# EAGLE design New_Glove (EAGLE 5.06)
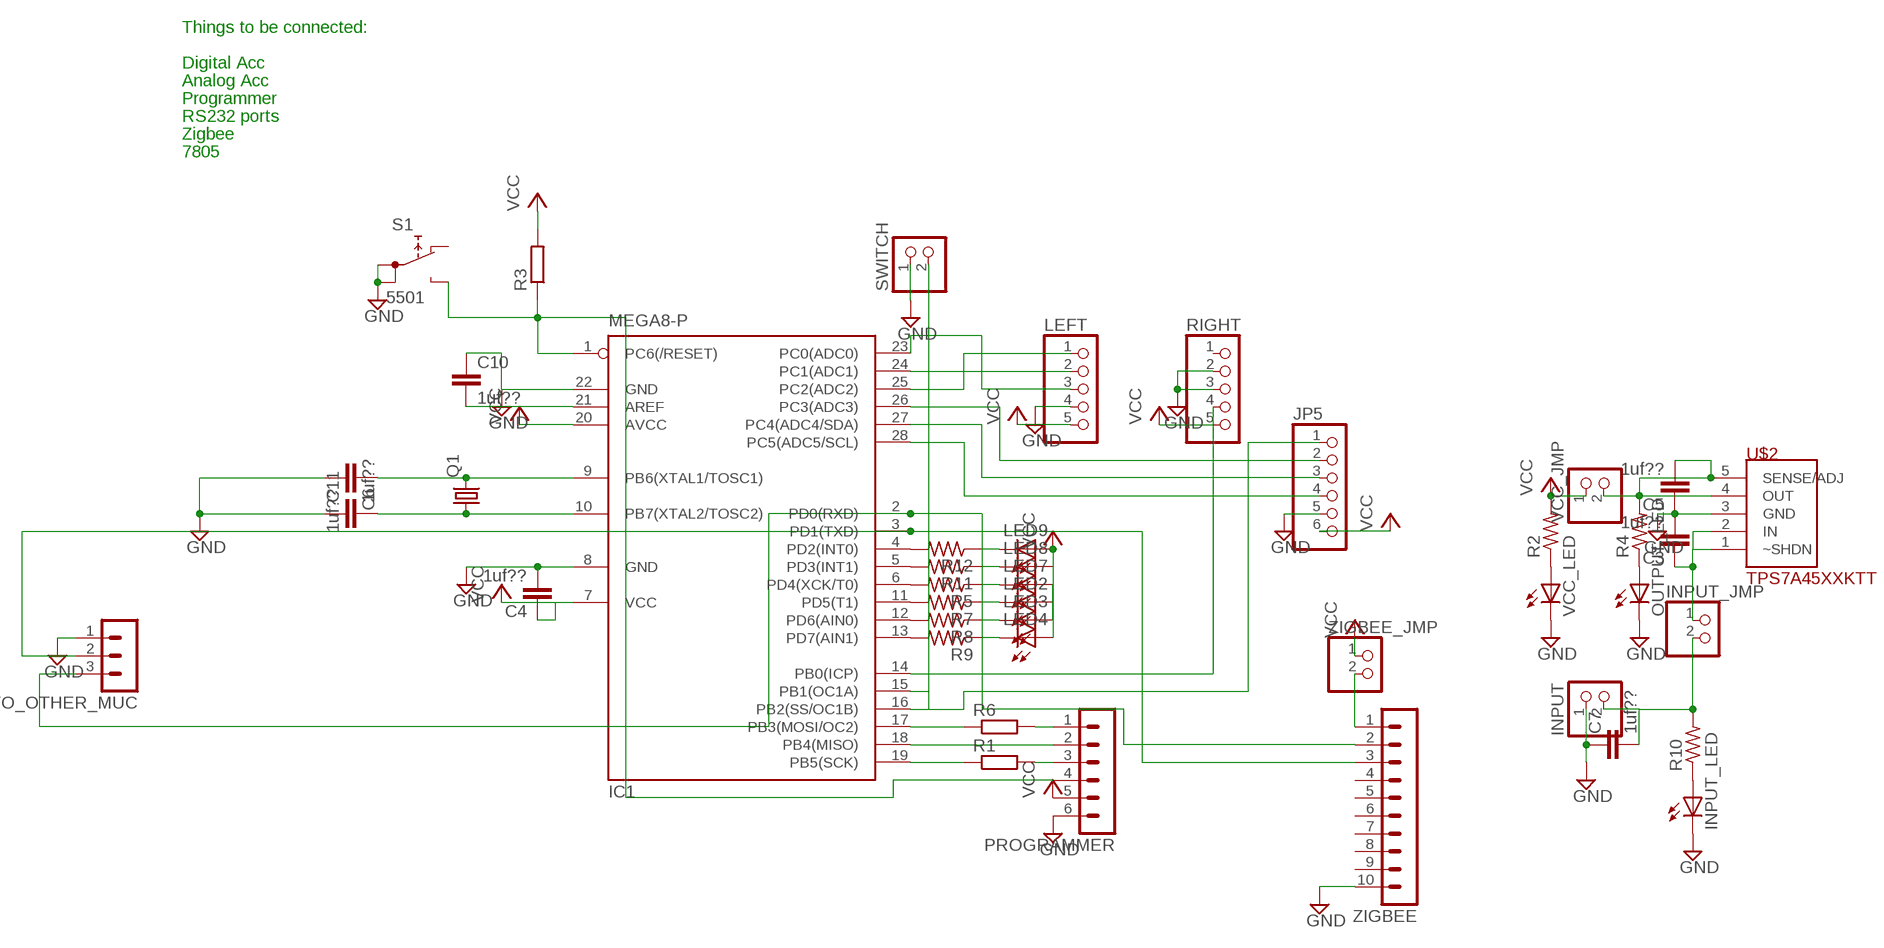
[diagram p0: schematic, sheet 1]

## Parts
C3  1uf??  C-EU025-025X050  [C025-025X050]
C4  1uf??  C-EU025-025X050  [C025-025X050]
C5  1uf??  C-EU025-025X050  [C025-025X050]
C6  1uf??  C-EU025-025X050  [C025-025X050]
C7  1uf??  C-EU025-025X050  [C025-025X050]
C10  1uf??  C-EU025-025X050  [C025-025X050]
C11  1uf??  C-EU025-025X050  [C025-025X050]
IC1  MEGA8-P  [DIL28-3]
INPUT  PINHD-1X2  [1X02]
INPUT_JMP  PINHD-1X2  [1X02]
INPUT_LED  LEDSMT1206  [1206]
JP5  PINHD-1X6  [1X06]
LED2  LEDSMT1206  [1206]
LED3  LEDSMT1206  [1206]
LED4  LEDSMT1206  [1206]
LED7  LEDSMT1206  [1206]
LED8  LEDSMT1206  [1206]
LED9  LEDSMT1206  [1206]
LEFT  PINHD-1X5  [1X05]
OUTPUT_LED  LEDSMT1206  [1206]
PROGRAMMER  MA06-1  [MA06-1]
Q1  CRYSTALHC49S  [HC49/S]
R1  R-EU_0207/7  [0207/7]
R2  R-US_R1206  [R1206]
R3  R-EU_0207/7  [0207/7]
R4  R-US_R1206  [R1206]
R5  R-US_R1206  [R1206]
R6  R-EU_0207/7  [0207/7]
R7  R-US_R1206  [R1206]
R8  R-US_R1206  [R1206]
R9  R-US_R1206  [R1206]
R10  R-US_R1206  [R1206]
R11  R-US_R1206  [R1206]
R12  R-US_R1206  [R1206]
RIGHT  PINHD-1X5  [1X05]
S1  5501  [5501]
SWITCH  PINHD-1X2  [1X02]
TO_OTHER_MUC  MA03-1  [MA03-1]
U$2  TPS7A45XXKTT  [TO263-5]
VCC_JMP  PINHD-1X2  [1X02]
VCC_LED  LEDSMT1206  [1206]
ZIGBEE  MA10-1  [MA10-1]
ZIGBEE_JMP  PINHD-1X2  [1X02]

## Nets
AC4: IC1.14(PB0(ICP)) RIGHT.4
GND: C3.2 C4.2 C5.1 C6.2 C7.1 C10.1 C11.1 IC1.8(GND) IC1.22(GND) INPUT.1 INPUT_LED.C JP5.5 LEFT.4 OUTPUT_LED.C PROGRAMMER.6 RIGHT.2 RIGHT.3 S1.1A S1.1B SWITCH.1 TO_OTHER_MUC.1 U$2.3(GND) VCC_LED.C ZIGBEE.10
N$1: IC1.17(PB3(MOSI/OC2)) R6.1
N$2: PROGRAMMER.1 R6.2
N$3: IC1.18(PB4(MISO)) PROGRAMMER.2
N$4: IC1.19(PB5(SCK)) R1.1
N$5: PROGRAMMER.3 R1.2
N$6: IC1.1(PC6(/RESET)) PROGRAMMER.4 R3.1 S1.NO
N$7: C11.2 IC1.10(PB7(XTAL2/TOSC2)) Q1.1
N$8: C6.1 IC1.9(PB6(XTAL1/TOSC1)) Q1.2
N$9: ZIGBEE.1 ZIGBEE_JMP.2
N$10: IC1.25(PC2(ADC2)) LEFT.1
N$11: IC1.24(PC1(ADC1)) LEFT.2
N$12: IC1.23(PC0(ADC0)) LEFT.3
N$13: R2.1 VCC_LED.A
N$14: IC1.26(PC3(ADC3)) JP5.2
N$15: C7.2 INPUT.2 INPUT_JMP.2 R10.2
N$16: IC1.27(PC4(ADC4/SDA)) JP5.3
N$17: OUTPUT_LED.A R4.1
N$18: IC1.2(PD0(RXD)) TO_OTHER_MUC.3 ZIGBEE.2
N$19: IC1.28(PC5(ADC5/SCL)) JP5.4
N$20: IC1.16(PB2(SS/OC1B)) JP5.1
N$21: C10.2 IC1.21(AREF)
N$23: IC1.6(PD4(XCK/T0)) R5.2
N$24: IC1.5(PD3(INT1)) R11.2
N$25: IC1.15(PB1(OC1A)) SWITCH.2
N$26: LED8.C R11.1
N$27: LED9.C R12.1
N$28: LED2.C R7.1
N$29: INPUT_LED.A R10.1
N$30: C5.2 R4.2 U$2.4(OUT) U$2.5(SENSE/ADJ) VCC_JMP.2
N$31: C3.1 INPUT_JMP.1 U$2.1(~SHDN) U$2.2(IN)
N$32: LED7.C R5.1
N$33: LED3.C R8.1
N$34: LED4.C R9.1
N$35: IC1.4(PD2(INT0)) R12.2
N$36: IC1.11(PD5(T1)) R7.2
N$37: IC1.12(PD6(AIN0)) R8.2
N$38: IC1.13(PD7(AIN1)) R9.2
N$39: IC1.3(PD1(TXD)) TO_OTHER_MUC.2 ZIGBEE.3
VCC: C4.1 IC1.7(VCC) IC1.20(AVCC) JP5.6 LED2.A LED3.A LED4.A LED7.A LED8.A LED9.A LEFT.5 PROGRAMMER.5 R2.2 R3.2 RIGHT.5 VCC_JMP.1 ZIGBEE_JMP.1
Unconnected: RIGHT.1 S1.NC ZIGBEE.4 ZIGBEE.5 ZIGBEE.6 ZIGBEE.7 ZIGBEE.8 ZIGBEE.9

## Notes on the sheet
- Things to be connected:
- Digital Acc
- Analog Acc
- Programmer
- RS232 ports
- Zigbee
- 7805

## Library data of the parts
C3-C7 C10 C11 = rcl:C-EU: CAPACITOR, European symbol
IC1 = atmel:MEGA8-P: MICROCONTROLLER 8 Kbytes FLASH, 1 kbytes SRAM, 512 bytes EEPROM, USART, 4-channel 10 bit ADC, 2-channel 8 bit ADC Pin compatible with Atmega48, ATMega88, ATMega168 Source: avr.lbr
INPUT INPUT_JMP SWITCH VCC_JMP ZIGBEE_JMP = pinhead:PINHD-1X2: PIN HEADER
INPUT_LED LED2-LED4 LED7-LED9 OUTPUT_LED VCC_LED = led:LED: LED OSRAM: - CHIPLED LG R971, LG N971, LY N971, LG Q971, LY Q971, LO R971, LY R971 LH N974, LH R974 LS Q976, LO Q976, LY Q976 LO Q996 - Hyper CHIPLED LW Q18S LB Q993, LB Q99A, LB R99A - SideLED LS A670, LO A670, LY A670, LG A670, LP A670 LB A673, LV A673, LT A673, LW A673 LH A674 LY A675 LS A676, LA A676, LO A676, LY A676, LW A676 LS A679, LY A679, LG A679 - Hyper Micro SIDELED® LS Y876, LA Y876, LO Y876, LY Y876 LT Y87S - SmartLED LW L88C, LW L88S LB L89C, LB L89S, LG L890 LS L89K, LO L89K, LY L89K LS L896, LA L896, LO L896, LY L896 - TOPLED LS T670, LO T670, LY T670, LG T670, LP T670 LSG T670, LSP T670, LSY T670, LOP T670, LYG T670 LG T671, LOG T671, LSG T671 LB T673, LV T673, LT T673, LW T673 LH T674 LS T676, LA T676, LO T676, LY T676, LB T676, LH T676, LSB T676, LW T676 LB T67C, LV T67C, LT T67C, LS T67K, LO T67K, LY T67K, LW E67C LS E67B, LA E67B, LO E67B, LY E67B, LB E67C, LV E67C, LT E67C LW T67C LS T679, LY T679, LG T679 LS T770, LO T770, LY T770, LG T770, LP T770 LB T773, LV T773, LT T773, LW T773 LH T774 LS E675, LA E675, LY E675, LS T675 LS T776, LA T776, LO T776, LY T776, LB T776 LHGB T686 LT T68C, LB T68C - Hyper Mini TOPLED® LB M676 - Mini TOPLED Santana® LG M470 LS M47K, LO M47K, LY M47K Source: http://www.osram.convergy.de LUXEON: - LUMILED® LXK2-PW12-R00, LXK2-PW12-S00, LXK2-PW14-U00, LXK2-PW14-V00 LXK2-PM12-R00, LXK2-PM12-S00, LXK2-PM14-U00 LXK2-PE12-Q00, LXK2-PE12-R00, LXK2-PE12-S00, LXK2-PE14-T00, LXK2-PE14-U00 LXK2-PB12-K00, LXK2-PB12-L00, LXK2-PB12-M00, LXK2-PB14-N00, LXK2-PB14-P00, LXK2-PB14-Q00 LXK2-PR12-L00, LXK2-PR12-M00, LXK2-PR14-Q00, LXK2-PR14-R00 LXK2-PD12-Q00, LXK2-PD12-R00, LXK2-PD12-S00 LXK2-PH12-R00, LXK2-PH12-S00 LXK2-PL12-P00, LXK2-PL12-Q00, LXK2-PL12-R00 Source: www.luxeon.com KINGBRIGHT: KA-3528ASYC Source: www.kingbright.com
JP5 = pinhead:PINHD-1X6: PIN HEADER
LEFT RIGHT = pinhead:PINHD-1X5: PIN HEADER
PROGRAMMER = con-lstb:MA06-1: PIN HEADER
Q1 = crystal:CRYSTAL: CRYSTAL
R1 R3 R6 = resistor:R-EU_: RESISTOR, European symbol
R2 R4 R5 R7-R12 = resistor:R-US_: RESISTOR, American symbol
S1 = switch:55?: PUSHBUTTON SERIES 5500 SWITCHES Source: www.e-switch.com .. 5500.pdf
TO_OTHER_MUC = con-lstb:MA03-1: PIN HEADER
U$2 = m:TPS7A45XX
ZIGBEE = con-lstb:MA10-1: PIN HEADER

## Board
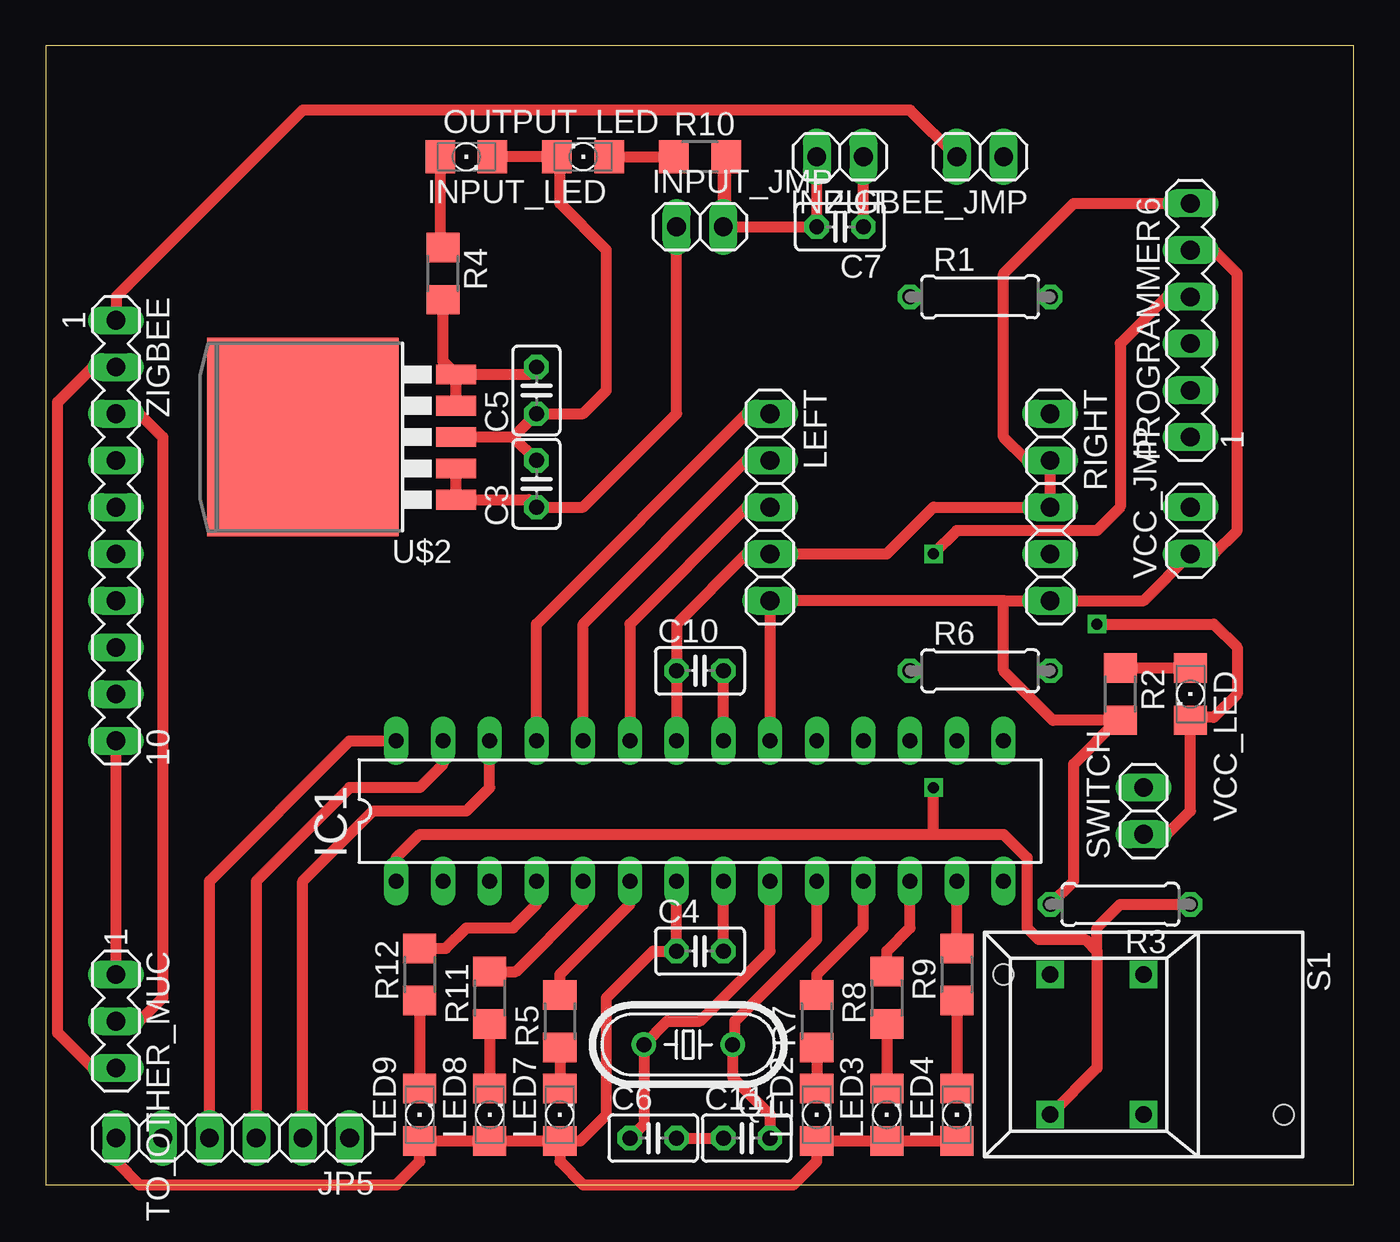
[diagram p1: board, top side]
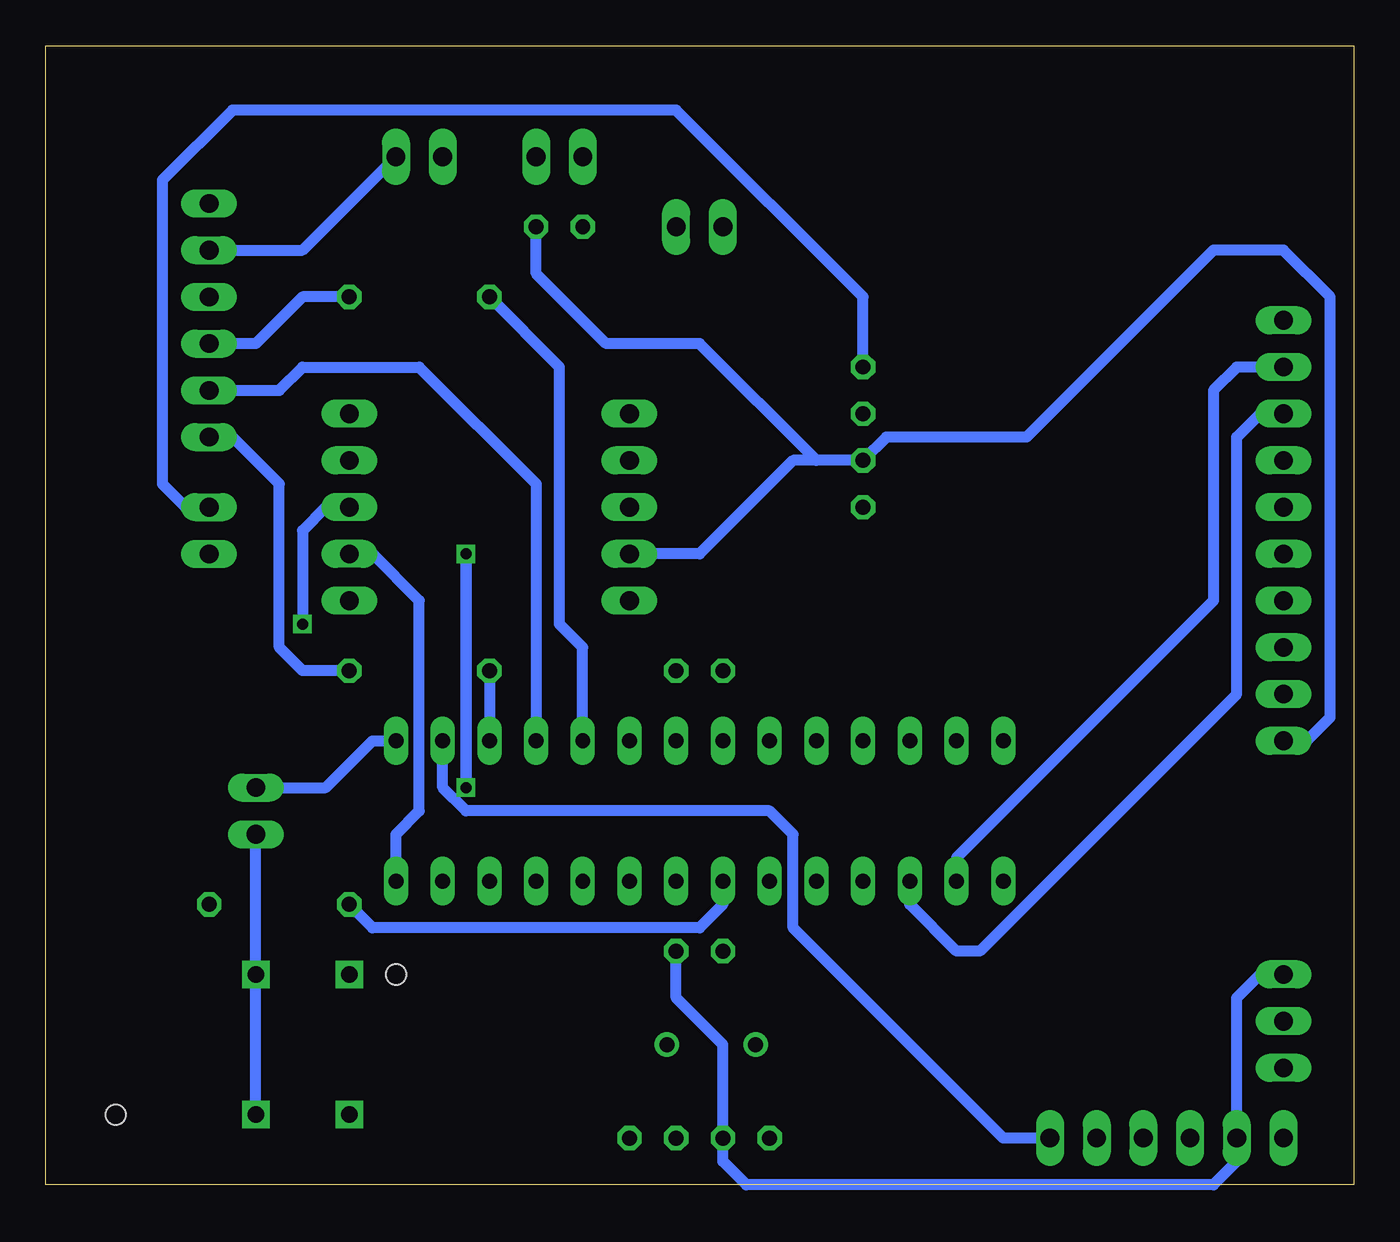
[diagram p2: board, bottom side, seen from below]

Size 71.1 x 61.9 mm. Coordinates in mm from the lower left corner, seen from the top.
Outline: 0,0 71.1,0 71.1,61.9 0,61.9 0,0
Copper layers (1*16): Top 0.035mm / dielectric 1.5mm / Bottom 0.035mm
Design rules "default": minimum track width 10mil, minimum drill 24mil, track to track 8mil, track to pad 8mil, pad to pad 8mil, via to via 8mil, smd to smd 8mil, copper to edge 40mil, drill to drill 8mil, minimum pad ring 10mil, minimum via ring 8mil, stop-mask expansion 4mil, vias tented up to drill 0mil, thermal gap 10mil

### Footprints (pad centres in the part's own frame; a part is rotated, then mirrored left to right if it is on the bottom)
C025-025X050 = drill 0.813 octagon: 1 -1.27,0; 2 1.27,0
DIL28-3 = drill 0.813 long: 1 -16.51,-3.81; 2 -13.97,-3.81; 3 -11.43,-3.81; 4 -8.89,-3.81; 5 -6.35,-3.81; 6 -3.81,-3.81; 7 -1.27,-3.81; 8 1.27,-3.81; 9 3.81,-3.81; 10 6.35,-3.81; 11 8.89,-3.81; 12 11.43,-3.81; 13 13.97,-3.81; 14 16.51,-3.81; 15 16.51,3.81; 16 13.97,3.81; 17 11.43,3.81; 18 8.89,3.81; 19 6.35,3.81; 20 3.81,3.81; 21 1.27,3.81; 22 -1.27,3.81; 23 -3.81,3.81; 24 -6.35,3.81; 25 -8.89,3.81; 26 -11.43,3.81; 27 -13.97,3.81; 28 -16.51,3.81
1X02 = drill 1.016 long: 1 -1.27,0; 2 1.27,0
1206 = smd 1.6 x 1.803: A -1.422,0; C 1.422,0
1X06 = drill 1.016 long: 1 -6.35,0; 2 -3.81,0; 3 -1.27,0; 4 1.27,0; 5 3.81,0; 6 6.35,0
1X05 = drill 1.016 long: 1 -5.08,0; 2 -2.54,0; 3 0,0; 4 2.54,0; 5 5.08,0
MA06-1 = drill 1.016 long: 1 -6.35,0; 2 -3.81,0; 3 -1.27,0; 4 1.27,0; 5 3.81,0; 6 6.35,0
HC49/S = drill 0.813 round: 1 -2.413,0; 2 2.413,0
0207/7 = drill 0.813 octagon: 1 -3.81,0; 2 3.81,0
R1206 = smd 1.6 x 1.803: 1 -1.422,0; 2 1.422,0
5501 = drill 0.9 pad 1.5 square: 1A 0,3.81; 1B 0,-3.81; NC 5.08,-3.81; NO 5.08,3.81 | hole 1.1: -7.62,3.81; 7.62,-3.81
MA03-1 = drill 1.016 long: 1 -2.54,0; 2 0,0; 3 2.54,0
TO263-5 = smd 1.067 x 2.159: 1 -3.404,-5.791; 2 -1.702,-5.791; 3 0,-5.791; 4 1.702,-5.791; 5 3.404,-5.791 | smd 10.8 x 10.41: 6 0,2.54
MA10-1 = drill 1.016 long: 1 -11.43,0; 2 -8.89,0; 3 -6.35,0; 4 -3.81,0; 5 -1.27,0; 6 1.27,0; 7 3.81,0; 8 6.35,0; 9 8.89,0; 10 11.43,0

### Placement (x,y rotation side)
C3  26.67,38.1 90 top
C4  35.56,12.7 0 top
C5  26.67,43.18 90 top
C6  33.02,2.54 0 top
C7  43.18,52.07 180 top
C10  35.56,27.94 0 top
C11  38.1,2.54 0 top
IC1  35.56,20.32 0 top
INPUT  43.18,55.88 180 top
INPUT_JMP  35.56,52.07 0 top
INPUT_LED  29.21,55.88 180 top
JP5  10.16,2.54 180 top
LED2  41.91,3.81 90 top
LED3  45.72,3.81 90 top
LED4  49.53,3.81 90 top
LED7  27.94,3.81 90 top
LED8  24.13,3.81 90 top
LED9  20.32,3.81 90 top
LEFT  39.37,36.83 270 top
OUTPUT_LED  22.86,55.88 0 top
PROGRAMMER  62.23,46.99 90 top
Q1  34.92,7.62 180 top
R1  50.8,48.26 0 top
R2  58.42,26.67 270 top
R3  58.42,15.24 180 top
R4  21.59,49.53 270 top
R5  27.94,8.89 90 top
R6  50.8,27.94 0 top
R7  41.91,8.89 90 top
R8  45.72,10.16 90 top
R9  49.53,11.43 90 top
R10  35.56,55.88 0 top
R11  24.13,10.16 90 top
R12  20.32,11.43 90 top
RIGHT  54.61,36.83 270 top
S1  59.69,7.62 180 top
SWITCH  59.69,20.32 90 top
TO_OTHER_MUC  3.81,8.89 270 top
U$2  16.51,40.64 90 top
VCC_JMP  62.23,35.56 90 top
VCC_LED  62.23,26.67 270 top
ZIGBEE  3.81,35.56 270 top
ZIGBEE_JMP  50.8,55.88 180 top

### Tracks (layer width: path | path; a pad name or v marks a point on that pad's centre or on a via)
AC4
  Bottom 0.61: RIGHT.4 53.34,34.29 50.8,31.75 50.8,20.32 52.07,19.05 IC1.14
GND  (via drill 0.6)
  Top 0.61: C4.2 IC1.8 | C6.2 C11.1 | OUTPUT_LED.C INPUT_LED.C 27.94,55.73 27.94,53.34 30.48,50.8 30.48,43.18 29.21,41.91 C5.1 25.4,40.64 | 25.4,40.64 U$2.3 | C3.2 25.4,40.64 | 34.29,30.48 C10.1 IC1.22 34.29,30.48 | C7.1 INPUT.1 | 60.96,53.34 PROGRAMMER.6 55.88,53.34 52.07,49.53 52.07,40.64 53.34,39.37 RIGHT.2 RIGHT.3 48.26,36.83 45.72,34.29 LEFT.4 38.1,34.29 34.29,30.48 | SWITCH.1 60.96,19.05 62.23,20.32 VCC_LED.C 62.38,25.4 63.5,25.4 64.77,26.67 64.77,29.21 63.5,30.48 v57.15,30.48 | TO_OTHER_MUC.1 ZIGBEE.10 TO_OTHER_MUC.1
  Bottom 0.61: C4.2 36.83,10.16 34.29,7.62 C6.2 34.29,1.27 33.02,0 7.62,0 6.35,1.27 JP5.5 6.35,10.16 5.08,11.43 TO_OTHER_MUC.1 | C7.1 44.45,49.53 40.64,45.72 35.56,45.72 29.21,39.37 | C3.2 29.21,39.37 | 29.21,39.37 30.48,39.37 | S1.1A S1.1B SWITCH.1 | LEFT.4 35.56,34.29 30.48,39.37 | C3.2 30.48,39.37 | C3.2 25.4,40.64 17.78,40.64 7.62,50.8 3.81,50.8 1.27,48.26 1.27,25.4 2.54,24.13 ZIGBEE.10 | RIGHT.3 55.88,36.83 57.15,35.56 v57.15,30.48
N$1
  Bottom 0.61: R6.1 IC1.17
N$2
  Bottom 0.61: PROGRAMMER.1 60.96,40.64 58.42,38.1 58.42,29.21 57.15,27.94 R6.2
N$3
  Bottom 0.61: PROGRAMMER.2 58.42,43.18 57.15,44.45 50.8,44.45 44.45,38.1 IC1.18
N$4
  Bottom 0.61: IC1.19 41.91,29.21 43.18,30.48 43.18,44.45 R1.1
N$5
  Bottom 0.61: R1.2 57.15,48.26 59.69,45.72 PROGRAMMER.3
N$6  (via drill 0.6)
  Top 0.61: R3.1 58.42,15.24 57.15,13.97 57.15,12.7 | 57.15,12.7 57.15,6.35 S1.NO | IC1.1 19.05,17.78 20.32,19.05 48.26,19.05 | 57.15,12.7 56.52,13.34 53.98,13.34 53.34,13.97 53.34,17.78 52.07,19.05 48.26,19.05 | PROGRAMMER.4 60.96,48.26 58.42,45.72 58.42,36.83 57.15,35.56 49.53,35.56 v48.26,34.29 | 48.26,19.05 v48.26,21.59
  Bottom 0.61: v48.26,21.59 v48.26,34.29 v48.26,21.59
N$7
  Top 0.61: IC1.10 41.91,13.34 37.47,8.89 37.47,7.75 Q1.1 37.34,5.84 39.37,3.81 C11.2
N$8
  Top 0.61: IC1.9 39.37,12.7 35.56,8.89 33.78,8.89 Q1.2 32.51,3.3 C6.1
N$9
  Top 0.61: ZIGBEE_JMP.2 46.99,58.42 13.97,58.42 3.81,48.26 ZIGBEE.1
N$10
  Top 0.61: IC1.25 26.67,30.48 38.1,41.91 LEFT.1
N$11
  Top 0.61: IC1.24 29.21,30.48 38.1,39.37 LEFT.2
N$12
  Top 0.61: LEFT.3 38.1,36.83 31.75,30.48 IC1.23
N$13
  Top 0.61: R2.1 VCC_LED.A
N$14
  Top 0.61: JP5.2 13.97,16.51 17.78,20.32 22.86,20.32 24.13,21.59 IC1.26
N$15
  Top 0.61: INPUT_JMP.2 36.83,55.73 R10.2 36.98,52.22 INPUT_JMP.2 | INPUT_JMP.2 C7.2 INPUT.2
N$16
  Top 0.61: IC1.27 21.59,22.86 20.32,21.59 16.51,21.59 11.43,16.51 JP5.3
N$17
  Top 0.61: OUTPUT_LED.A 21.44,51.1 R4.1
N$18
  Top 0.61: TO_OTHER_MUC.3 2.54,6.35 0.64,8.26 0.64,42.55 2.54,44.45 ZIGBEE.2
  Bottom 0.61: IC1.2 21.59,17.78 7.62,31.75 7.62,43.18 6.35,44.45 ZIGBEE.2
N$19
  Top 0.61: JP5.4 8.89,16.51 16.51,24.13 IC1.28
N$20
  Bottom 0.61: JP5.1 19.05,2.54 30.48,13.97 30.48,19.05 31.75,20.32 48.26,20.32 49.53,21.59 IC1.16
N$21
  Top 0.61: IC1.21 C10.2
N$23
  Top 0.61: R5.2 27.94,11.43 31.75,15.24 IC1.6
N$24
  Top 0.61: R11.2 25.55,11.58 29.21,15.24 IC1.5
N$25
  Bottom 0.61: SWITCH.2 55.88,21.59 53.34,24.13 IC1.15
N$26
  Top 0.61: R11.1 LED8.C
N$27
  Top 0.61: R12.1 LED9.C
N$28
  Top 0.61: R7.1 LED2.C
N$29
  Top 0.61: INPUT_LED.A R10.1
N$30
  Top 0.61: R4.2 21.59,44.76 U$2.5 | U$2.4 U$2.5 | U$2.5 26.26,44.04 C5.2
  Bottom 0.61: C5.2 26.67,48.26 36.83,58.42 60.96,58.42 64.77,54.61 64.77,38.1 63.5,36.83 VCC_JMP.2
N$31
  Top 0.61: U$2.2 U$2.1 26.26,37.24 C3.1 29.21,36.83 34.29,41.91 INPUT_JMP.1
N$32
  Top 0.61: R5.1 LED7.C
N$33
  Top 0.61: R8.1 LED3.C
N$34
  Top 0.61: R9.1 LED4.C
N$35
  Top 0.61: R12.2 21.74,12.85 22.86,13.97 25.4,13.97 26.67,15.24 IC1.4
N$36
  Top 0.61: R7.2 41.91,11.43 44.45,13.97 IC1.11
N$37
  Top 0.61: R8.2 45.72,12.7 46.99,13.97 IC1.12
N$38
  Top 0.61: R9.2 IC1.13
N$39
  Top 0.61: ZIGBEE.3 5.08,41.91 6.35,40.64 6.35,10.16 5.08,8.89 TO_OTHER_MUC.2
  Bottom 0.61: IC1.3 24.13,15.24 21.59,12.7 20.32,12.7 6.35,26.67 6.35,40.64 5.08,41.91 ZIGBEE.3
VCC
  Top 0.61: LED7.A LED8.A LED9.A 20.32,1.27 19.05,0 5.08,0 3.81,1.27 JP5.6 | LED4.A LED3.A LED2.A 41.91,1.27 40.64,0 29.21,0 27.94,1.27 LED7.A | IC1.7 C4.1 33.02,12.7 30.48,10.16 30.48,3.81 29.06,2.39 LED7.A | IC1.20 LEFT.5 52.07,31.75 | 52.07,31.75 RIGHT.5 59.69,31.75 VCC_JMP.1 63.5,34.29 64.77,35.56 64.77,49.53 63.5,50.8 PROGRAMMER.5 | R3.2 55.88,16.51 55.88,22.86 58.27,25.25 R2.2 54.76,25.25 52.07,27.94 52.07,31.75
  Bottom 0.61: ZIGBEE_JMP.1 57.15,50.8 PROGRAMMER.5 | IC1.7 34.29,15.24 35.56,13.97 53.34,13.97 R3.2